# Altium schematic sheet Connexions.SchDoc
size A; SheetNumber: 1; SheetTotal: 2
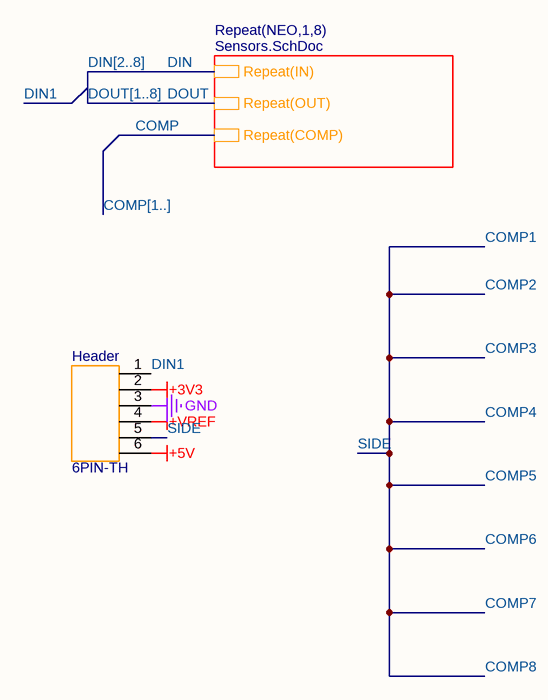
[diagram p0: Connexions.SchDoc]

## Parts
Header  6PIN-TH  [6PIN-TH]

## Sub-sheets
Repeat(NEO,1,8) = Sensors.SchDoc: Repeat(IN), Repeat(OUT), Repeat(COMP)

## Nets
+3V3: Header.2
+5V: Header.6
+VREF: Header.4
GND: Header.3
COMP: sheet Repeat(NEO,1,8)/Repeat(COMP)
COMP1: Header.5  [also labelled COMP2, COMP3, COMP4, COMP5, COMP6, COMP7, COMP8, SIDE]
DIN: sheet Repeat(NEO,1,8)/Repeat(IN)
DIN1: Header.1
DOUT: sheet Repeat(NEO,1,8)/Repeat(OUT)

## Buses and harness runs
bus COMP[1..]
bus DIN[2..8] = DOUT[1..8]